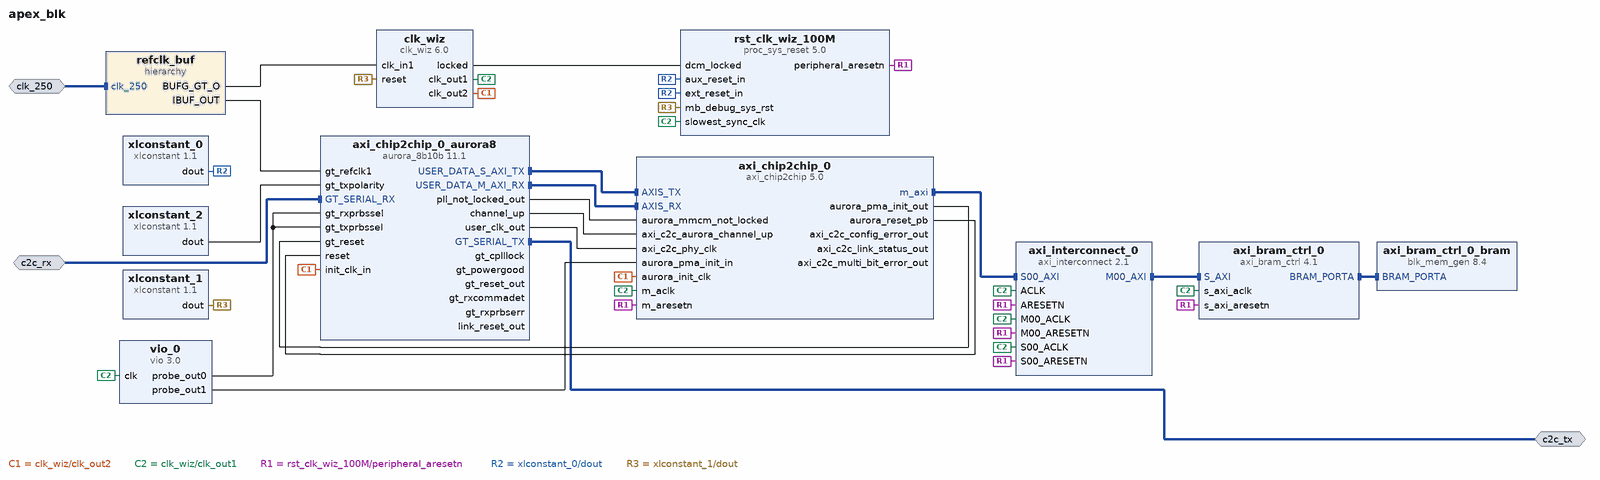
[diagram p0: block diagram of the top level]
# Vivado block design apex_blk, xcku15p-ffva1760-2-e, Vivado 2020.1
create_bd_design apex_blk

create_bd_intf_port -mode Master -vlnv xilinx.com:display_aurora:GT_Serial_Transceiver_Pins_TX_rtl:1.0 c2c_tx
create_bd_intf_port -mode Slave -vlnv xilinx.com:display_aurora:GT_Serial_Transceiver_Pins_RX_rtl:1.0 c2c_rx
create_bd_intf_port -mode Slave -vlnv xilinx.com:interface:diff_clock_rtl:1.0 clk_250
set_property -dict {CONFIG.FREQ_HZ 250000000} [get_bd_intf_ports clk_250]

create_bd_cell -type ip -vlnv xilinx.com:ip:axi_interconnect:2.1 axi_interconnect_0
set_property -dict {CONFIG.NUM_MI 1} [get_bd_cells axi_interconnect_0]
create_bd_cell -type ip -vlnv xilinx.com:ip:axi_bram_ctrl:4.1 axi_bram_ctrl_0
set_property -dict {CONFIG.SINGLE_PORT_BRAM 1} [get_bd_cells axi_bram_ctrl_0]
create_bd_cell -type ip -vlnv xilinx.com:ip:blk_mem_gen:8.4 axi_bram_ctrl_0_bram
create_bd_cell -type ip -vlnv xilinx.com:ip:clk_wiz:6.0 clk_wiz
set_property -dict [list \
  CONFIG.CLKOUT2_JITTER 153.164 \
  CONFIG.CLKOUT2_PHASE_ERROR 154.678 \
  CONFIG.CLKOUT2_REQUESTED_OUT_FREQ 50 \
  CONFIG.CLKOUT2_USED true \
  CONFIG.MMCM_CLKOUT1_DIVIDE 24 \
  CONFIG.NUM_OUT_CLKS 2 \
] [get_bd_cells clk_wiz]
create_bd_cell -type ip -vlnv xilinx.com:ip:proc_sys_reset:5.0 rst_clk_wiz_100M
create_bd_cell -type ip -vlnv xilinx.com:ip:xlconstant:1.1 xlconstant_0
create_bd_cell -type ip -vlnv xilinx.com:ip:xlconstant:1.1 xlconstant_1
set_property -dict {CONFIG.CONST_VAL 0} [get_bd_cells xlconstant_1]
create_bd_cell -type hier refclk_buf
create_bd_cell -type ip -vlnv xilinx.com:ip:aurora_8b10b:11.1 axi_chip2chip_0_aurora8
set_property -dict [list \
  CONFIG.CHANNEL_ENABLE X0Y12 \
  CONFIG.C_AURORA_LANES 1 \
  CONFIG.C_DRP_IF false \
  CONFIG.C_LANE_WIDTH 4 \
  CONFIG.C_LINE_RATE 3.75 \
  CONFIG.C_REFCLK_FREQUENCY 250 \
  CONFIG.C_REFCLK_SOURCE {MGTREFCLK0 of Quad X0Y3} \
  CONFIG.C_START_LANE X0Y12 \
  CONFIG.C_START_QUAD Quad_X0Y3 \
  CONFIG.Interface_Mode Streaming \
  CONFIG.SINGLEEND_GTREFCLK true \
  CONFIG.SupportLevel 1 \
  CONFIG.TransceiverControl true \
] [get_bd_cells axi_chip2chip_0_aurora8]
create_bd_cell -type ip -vlnv xilinx.com:ip:axi_chip2chip:5.0 axi_chip2chip_0
set_property -dict [list \
  CONFIG.C_ECC_ENABLE false \
  CONFIG.C_INTERFACE_MODE 1 \
  CONFIG.C_INTERFACE_TYPE 3 \
  CONFIG.C_MASTER_FPGA 0 \
  CONFIG.C_M_AXI_WUSER_WIDTH 0 \
] [get_bd_cells axi_chip2chip_0]
create_bd_cell -type ip -vlnv xilinx.com:ip:xlconstant:1.1 xlconstant_2
set_property -dict {CONFIG.CONST_VAL 0} [get_bd_cells xlconstant_2]
create_bd_cell -type ip -vlnv xilinx.com:ip:vio:3.0 vio_0
set_property -dict {CONFIG.C_NUM_PROBE_IN 0 CONFIG.C_NUM_PROBE_OUT 2 CONFIG.C_PROBE_OUT0_WIDTH 4} [get_bd_cells vio_0]

# ---- hierarchy /refclk_buf ----
current_bd_instance /refclk_buf
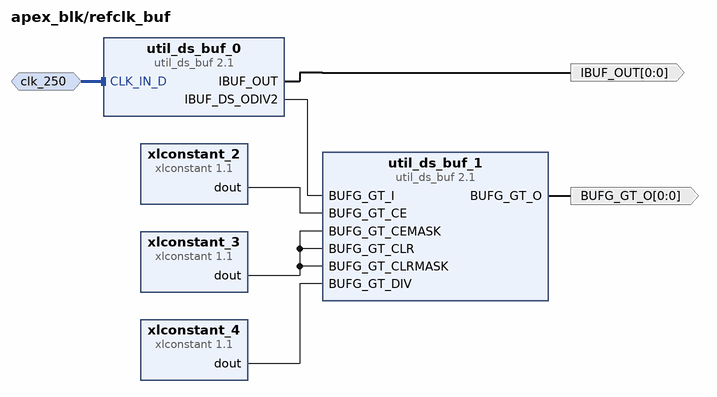
[diagram p1: block diagram inside /refclk_buf]
create_bd_intf_pin -mode Slave -vlnv xilinx.com:interface:diff_clock_rtl:1.0 clk_250
create_bd_pin -dir O -from 0 -to 0 -type clk IBUF_OUT
create_bd_pin -dir O -from 0 -to 0 -type clk BUFG_GT_O

create_bd_cell -type ip -vlnv xilinx.com:ip:util_ds_buf:2.1 util_ds_buf_0
set_property -dict {CONFIG.C_BUF_TYPE IBUFDSGTE} [get_bd_cells util_ds_buf_0]
create_bd_cell -type ip -vlnv xilinx.com:ip:util_ds_buf:2.1 util_ds_buf_1
set_property -dict {CONFIG.C_BUF_TYPE BUFG_GT} [get_bd_cells util_ds_buf_1]
create_bd_cell -type ip -vlnv xilinx.com:ip:xlconstant:1.1 xlconstant_3
set_property -dict {CONFIG.CONST_VAL 0} [get_bd_cells xlconstant_3]
create_bd_cell -type ip -vlnv xilinx.com:ip:xlconstant:1.1 xlconstant_4
set_property -dict {CONFIG.CONST_VAL 0 CONFIG.CONST_WIDTH 3} [get_bd_cells xlconstant_4]
create_bd_cell -type ip -vlnv xilinx.com:ip:xlconstant:1.1 xlconstant_2

# ---- connections ----

current_bd_instance /refclk_buf
connect_bd_intf_net -intf_net CLK_IN_D_0_1 [get_bd_intf_pins clk_250] [get_bd_intf_pins util_ds_buf_0/CLK_IN_D]
connect_bd_net [get_bd_pins util_ds_buf_0/IBUF_DS_ODIV2] [get_bd_pins util_ds_buf_1/BUFG_GT_I]
connect_bd_net [get_bd_pins xlconstant_2/dout] [get_bd_pins util_ds_buf_1/BUFG_GT_CE]
connect_bd_net [get_bd_pins xlconstant_3/dout] \
  [get_bd_pins util_ds_buf_1/BUFG_GT_CEMASK] [get_bd_pins util_ds_buf_1/BUFG_GT_CLR] \
  [get_bd_pins util_ds_buf_1/BUFG_GT_CLRMASK]
connect_bd_net [get_bd_pins xlconstant_4/dout] [get_bd_pins util_ds_buf_1/BUFG_GT_DIV]
connect_bd_net [get_bd_pins util_ds_buf_0/IBUF_OUT] [get_bd_pins IBUF_OUT]
connect_bd_net [get_bd_pins util_ds_buf_1/BUFG_GT_O] [get_bd_pins BUFG_GT_O]

current_bd_instance /
connect_bd_intf_net [get_bd_intf_pins axi_interconnect_0/M00_AXI] [get_bd_intf_pins axi_bram_ctrl_0/S_AXI]
connect_bd_intf_net [get_bd_intf_pins axi_bram_ctrl_0_bram/BRAM_PORTA] [get_bd_intf_pins axi_bram_ctrl_0/BRAM_PORTA]
connect_bd_intf_net -intf_net CLK_IN_D_0_1 [get_bd_intf_ports clk_250] [get_bd_intf_pins refclk_buf/clk_250]
connect_bd_intf_net [get_bd_intf_pins axi_chip2chip_0_aurora8/USER_DATA_S_AXI_TX] [get_bd_intf_pins axi_chip2chip_0/AXIS_TX]
connect_bd_intf_net [get_bd_intf_pins axi_chip2chip_0_aurora8/USER_DATA_M_AXI_RX] [get_bd_intf_pins axi_chip2chip_0/AXIS_RX]
connect_bd_intf_net [get_bd_intf_pins axi_interconnect_0/S00_AXI] [get_bd_intf_pins axi_chip2chip_0/m_axi]
connect_bd_intf_net [get_bd_intf_ports c2c_tx] [get_bd_intf_pins axi_chip2chip_0_aurora8/GT_SERIAL_TX]
connect_bd_intf_net [get_bd_intf_ports c2c_rx] [get_bd_intf_pins axi_chip2chip_0_aurora8/GT_SERIAL_RX]
connect_bd_net [get_bd_pins clk_wiz/clk_out2] [get_bd_pins axi_chip2chip_0_aurora8/init_clk_in] [get_bd_pins axi_chip2chip_0/aurora_init_clk]
connect_bd_net [get_bd_pins clk_wiz/clk_out1] \
  [get_bd_pins axi_interconnect_0/S00_ACLK] [get_bd_pins rst_clk_wiz_100M/slowest_sync_clk] \
  [get_bd_pins axi_bram_ctrl_0/s_axi_aclk] [get_bd_pins axi_interconnect_0/M00_ACLK] [get_bd_pins axi_interconnect_0/ACLK] \
  [get_bd_pins axi_chip2chip_0/m_aclk] [get_bd_pins vio_0/clk]
connect_bd_net [get_bd_pins clk_wiz/locked] [get_bd_pins rst_clk_wiz_100M/dcm_locked]
connect_bd_net [get_bd_pins rst_clk_wiz_100M/peripheral_aresetn] \
  [get_bd_pins axi_interconnect_0/S00_ARESETN] [get_bd_pins axi_bram_ctrl_0/s_axi_aresetn] \
  [get_bd_pins axi_interconnect_0/M00_ARESETN] [get_bd_pins axi_interconnect_0/ARESETN] \
  [get_bd_pins axi_chip2chip_0/m_aresetn]
connect_bd_net [get_bd_pins xlconstant_0/dout] [get_bd_pins rst_clk_wiz_100M/ext_reset_in] [get_bd_pins rst_clk_wiz_100M/aux_reset_in]
connect_bd_net [get_bd_pins xlconstant_1/dout] [get_bd_pins clk_wiz/reset] [get_bd_pins rst_clk_wiz_100M/mb_debug_sys_rst]
connect_bd_net -net util_ds_buf_1_BUFG_GT_O [get_bd_pins refclk_buf/BUFG_GT_O] [get_bd_pins clk_wiz/clk_in1]
connect_bd_net [get_bd_pins refclk_buf/IBUF_OUT] [get_bd_pins axi_chip2chip_0_aurora8/gt_refclk1]
connect_bd_net -net c2c_dout [get_bd_pins xlconstant_2/dout] [get_bd_pins axi_chip2chip_0_aurora8/gt_txpolarity]
connect_bd_net -net axi_chip2chip_0_aurora_pma_init_out [get_bd_pins axi_chip2chip_0/aurora_pma_init_out] \
  [get_bd_pins axi_chip2chip_0_aurora8/gt_reset]
connect_bd_net -net axi_chip2chip_0_aurora_reset_pb [get_bd_pins axi_chip2chip_0/aurora_reset_pb] [get_bd_pins axi_chip2chip_0_aurora8/reset]
connect_bd_net -net axi_chip2chip_0_aurora8_pll_not_locked_out [get_bd_pins axi_chip2chip_0_aurora8/pll_not_locked_out] \
  [get_bd_pins axi_chip2chip_0/aurora_mmcm_not_locked]
connect_bd_net -net axi_chip2chip_0_aurora8_channel_up [get_bd_pins axi_chip2chip_0_aurora8/channel_up] \
  [get_bd_pins axi_chip2chip_0/axi_c2c_aurora_channel_up]
connect_bd_net [get_bd_pins axi_chip2chip_0_aurora8/user_clk_out] [get_bd_pins axi_chip2chip_0/axi_c2c_phy_clk]
connect_bd_net -net vio_0_probe_out0 [get_bd_pins vio_0/probe_out0] \
  [get_bd_pins axi_chip2chip_0_aurora8/gt_rxprbssel] [get_bd_pins axi_chip2chip_0_aurora8/gt_txprbssel]
# net gt_rxprbserr has one end: axi_chip2chip_0_aurora8/gt_rxprbserr
connect_bd_net -net vio_0_probe_out1 [get_bd_pins vio_0/probe_out1] [get_bd_pins axi_chip2chip_0/aurora_pma_init_in]
# net axi_c2c_config_error_out has one end: axi_chip2chip_0/axi_c2c_config_error_out
# net axi_c2c_link_status_out has one end: axi_chip2chip_0/axi_c2c_link_status_out
# net axi_c2c_multi_bit_error_out has one end: axi_chip2chip_0/axi_c2c_multi_bit_error_out
# net gt_cplllock has one end: axi_chip2chip_0_aurora8/gt_cplllock
# net gt_rxcommadet has one end: axi_chip2chip_0_aurora8/gt_rxcommadet
# net gt_reset_out has one end: axi_chip2chip_0_aurora8/gt_reset_out
# net gt_powergood has one end: axi_chip2chip_0_aurora8/gt_powergood
# net link_reset_out has one end: axi_chip2chip_0_aurora8/link_reset_out
set_property HDL_ATTRIBUTE.DEBUG true [get_bd_nets axi_chip2chip_0_aurora_pma_init_out]
set_property HDL_ATTRIBUTE.MARK_DEBUG true [get_bd_nets axi_chip2chip_0_aurora_pma_init_out]
set_property HDL_ATTRIBUTE.DEBUG true [get_bd_nets axi_chip2chip_0_aurora_reset_pb]
set_property HDL_ATTRIBUTE.MARK_DEBUG true [get_bd_nets axi_chip2chip_0_aurora_reset_pb]
set_property HDL_ATTRIBUTE.DEBUG true [get_bd_nets axi_chip2chip_0_aurora8_pll_not_locked_out]
set_property HDL_ATTRIBUTE.MARK_DEBUG true [get_bd_nets axi_chip2chip_0_aurora8_pll_not_locked_out]
set_property HDL_ATTRIBUTE.DEBUG true [get_bd_nets axi_chip2chip_0_aurora8_channel_up]
set_property HDL_ATTRIBUTE.MARK_DEBUG true [get_bd_nets axi_chip2chip_0_aurora8_channel_up]
set_property HDL_ATTRIBUTE.DEBUG true [get_bd_nets vio_0_probe_out0]
set_property HDL_ATTRIBUTE.MARK_DEBUG true [get_bd_nets vio_0_probe_out0]
set_property HDL_ATTRIBUTE.DEBUG true [get_bd_nets gt_rxprbserr]
set_property HDL_ATTRIBUTE.MARK_DEBUG true [get_bd_nets gt_rxprbserr]
set_property HDL_ATTRIBUTE.DEBUG true [get_bd_nets vio_0_probe_out1]
set_property HDL_ATTRIBUTE.MARK_DEBUG true [get_bd_nets vio_0_probe_out1]
set_property HDL_ATTRIBUTE.DEBUG true [get_bd_nets axi_c2c_config_error_out]
set_property HDL_ATTRIBUTE.MARK_DEBUG true [get_bd_nets axi_c2c_config_error_out]
set_property HDL_ATTRIBUTE.DEBUG true [get_bd_nets axi_c2c_link_status_out]
set_property HDL_ATTRIBUTE.MARK_DEBUG true [get_bd_nets axi_c2c_link_status_out]
set_property HDL_ATTRIBUTE.DEBUG true [get_bd_nets axi_c2c_multi_bit_error_out]
set_property HDL_ATTRIBUTE.MARK_DEBUG true [get_bd_nets axi_c2c_multi_bit_error_out]
set_property HDL_ATTRIBUTE.DEBUG true [get_bd_nets gt_cplllock]
set_property HDL_ATTRIBUTE.MARK_DEBUG true [get_bd_nets gt_cplllock]
set_property HDL_ATTRIBUTE.DEBUG true [get_bd_nets gt_rxcommadet]
set_property HDL_ATTRIBUTE.MARK_DEBUG true [get_bd_nets gt_rxcommadet]
set_property HDL_ATTRIBUTE.DEBUG true [get_bd_nets gt_reset_out]
set_property HDL_ATTRIBUTE.MARK_DEBUG true [get_bd_nets gt_reset_out]
set_property HDL_ATTRIBUTE.DEBUG true [get_bd_nets gt_powergood]
set_property HDL_ATTRIBUTE.MARK_DEBUG true [get_bd_nets gt_powergood]
set_property HDL_ATTRIBUTE.DEBUG true [get_bd_nets link_reset_out]
set_property HDL_ATTRIBUTE.MARK_DEBUG true [get_bd_nets link_reset_out]

# ---- address map ----
assign_bd_address -offset 0x7AA00000 -range 128K -target_address_space [get_bd_addr_spaces axi_chip2chip_0/MAXI] [get_bd_addr_segs axi_bram_ctrl_0/S_AXI/Mem0]

validate_bd_design
save_bd_design
